# Altium schematic sheet Power.SchDoc
size A3
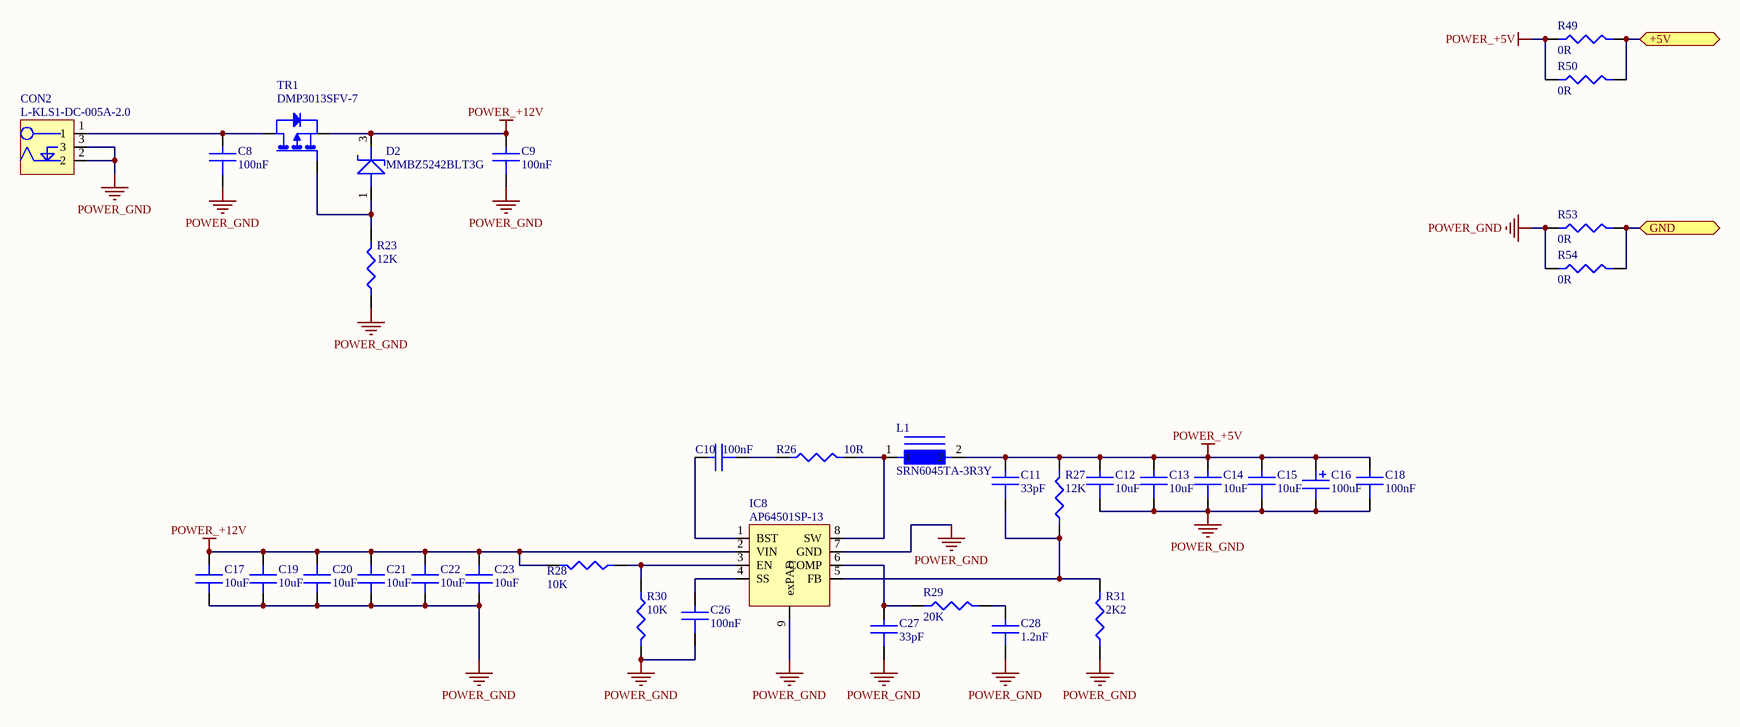
[diagram p0: Power.SchDoc]

## Parts
C8  100nF  [C0805]
C9  100nF  [C0603]
C10  100nF  [C0603]
C11  33pF  [C0603]
C12  10uF  [C0603]
C13  10uF  [C0603]
C14  10uF  [C0603]
C15  10uF  [C0603]
C16  100uF  [CT3528]
C17  10uF  [C0805]
C18  100nF  [C0603]
C19  10uF  [C0805]
C20  10uF  [C0805]
C21  10uF  [C0805]
C22  10uF  [C0805]
C23  10uF  [C0805]
C26  100nF  [C0603]
C27  33pF  [C0603]
C28  1.2nF  [C0603]
CON2  L-KLS1-DC-005A-2.0  [L-KLS1-DC-005A-2.0]
D2  MMBZ5242BLT3G  [SOT23]
IC8  AP64501SP-13  [SO-8EP]
L1  SRN6045TA-3R3Y  [SRN6045TA]
R23  12K  [R0603]
R26  10R  [R0603]
R27  12K  [R0603]
R28  10K  [R0603]
R29  20K  [R0603]
R30  10K  [R0603]
R31  2K2  [R0603]
R49  0R  [R0603]
R50  0R  [R0603]
R53  0R  [R0603]
R54  0R  [R0603]
TR1  DMP3013SFV-7  [PowerDI3333-8]

## Ports
+5V (bidir), GND (bidir)

## Nets
POWER_+5V: C11.1 C12.1 C13.1 C14.1 C15.1 C16.1 C18.1 L1.2 R27.2 R49.1 R50.1
POWER_+12V: C9.1 C17.2 C19.2 C20.2 C21.2 C22.2 C23.2 D2.3(K) IC8.2(VIN) R28.2 TR1.1(S)
POWER_GND: C8.2 C9.2 C12.2 C13.2 C14.2 C15.2 C16.2 C17.1 C18.2 C19.1 C20.1 C21.1 C22.1 C23.1 C26.2 C27.2 C28.2 CON2.2 CON2.3 IC8.7(GND) IC8.9(exPAD) R23.1 R30.2 R31.1 R53.1 R54.1
+5V: R49.2 R50.2 ; port +5V
GND: R53.2 R54.2 ; port GND
NetC8_1: C8.1 CON2.1 TR1.3(D)
NetC10_1: C10.1 IC8.1(BST)
NetC10_2: C10.2 R26.1
NetC11_2: C11.2 IC8.5(FB) R27.1 R31.2
NetC26_1: C26.1 IC8.4(SS)
NetC27_1: C27.1 IC8.6(COMP) R29.1
NetC28_1: C28.1 R29.2
NetD2_1: D2.1(A) R23.2 TR1.2(G)
NetIC8_3: IC8.3(EN) R28.1 R30.1
NetIC8_8: IC8.8(SW) L1.1 R26.2

## Notes on the sheet
- Tarih/Date
- Kont/Check
- Onay/Appr
- Haz/Prep
- Ortam/Env
- Sayfa/Sht
- Form
- /
- Deg Tarihi/Chng Date
- Deg Onay/Chng Appr
- Rev
- All rights reserved. No part of this document may be reproduced or transmitted in any form or by any means, electronic, mechanical, photocopying, recording, or otherwise, without prior written permission of

## Library data of the parts
C8 = CL21B104MBCNNNC: 100nF 50V X7R 20% SMD 0805 125C Paper T/R; Manufacturer: Samsung; Supplier 1: Digi-Key; Manufacturer Part Number: CL21B104MBCNNNC; Stock 1: 602; Pricing 1: 1 = 0,10000, 10 = 0,04500, 100 = 0,02020, 500 = 0,01444, 1000 = 0,01134 (USD); RoHS: Yes; Mount: Surface Mount; Case/Package: 0805; Case Code (Imperial): 0805; Case Code (Metric): 2012; Min Operating Temperature: -55°C; Max Operating Temperature: 125°C; Capacitance: 100nF; Tolerance: 20%; Dielectric: X7R; Voltage: 50V; Package Quantity: 1; Packaging: Tape and Reel; Voltage Rating: 50V; Voltage Rating (DC): 50V; Length: 2mm; Height: 0.85mm; Depth: 1.25mm; Width: 0.049inch; Thickness: 0.037inch; Radiation Hardening: No; Lead Free: Lead Free; ComponentLink1URL: https://datasheet.ciiva.com/25780/cl21b104mbcnnnc-25780224.pdf?src-supplier=Digi-Key; ComponentLink1Description: https://datasheet.ciiva.com/25780/cl21b104mbcnnnc-25780224.pdf?src-supplier=Digi-Key; ComponentLink2URL: https://datasheet.ciiva.com/16428/cl21b104mbcnnnc-16428869.pdf?src-supplier=Future+Electronics; ComponentLink2Description: https://datasheet.ciiva.com/16428/cl21b104mbcnnnc-16428869.pdf?src-supplier=Future+Electronics; ComponentLink3URL: https://datasheet.ciiva.com/26838/getdatasheetpartid-746552-26838664.pdf?src-supplier=Verical; ComponentLink3Description: https://datasheet.ciiva.com/26838/getdatasheetpartid-746552-26838664.pdf?src-supplier=Verical; Supplier Part Number 1: 1276-2450-1-ND; Category: Capasitor
C9 C10 C18 C26 = CC0603KRX7R8BB104: 100nF, 25V, X7R, 10%, 0603; Manufacturer: Yageo; Supplier 1: Digi-Key; Supplier Part Number 1: 311-1341-1-ND; Manufacturer Part Number: CC0603KRX7R8BB104; Stock 1: 10150433; Pricing 1: 1 = 0,10000, 10 = 0,04500, 50 = 0,02480, 100 = 0,02020, 500 = 0,01444, 1000 = 0,01134 (USD); RoHS: Yes; Mount: Surface Mount; Case/Package: 0603; Number of Pins: 2; Case Code (Imperial): 0603; Case Code (Metric): 1608; Min Operating Temperature: -55°C; Max Operating Temperature: 125°C; Capacitance: 100nF; Tolerance: 10%; Voltage Rating: 25V; Packaging: Tape and Reel; Package Quantity: 1; Voltage Rating (DC): 25V; Dielectric: X7R; Termination: SMD/SMT; Resistor Type: Ceramic; Voltage: 25V; Length: 1.6mm; Width: 0.8mm; Height: 0.8mm; Thickness: 0.035inch; Depth: 0.8mm; Radiation Hardening: No; REACH SVHC: Unknown; Lead Free: Lead Free; Halogen Free: Halogen Free; ComponentLink1URL: https://datasheet.ciiva.com/11786/0900766b80c10176-11786120.pdf?src-supplier=RSComponents; ComponentLink1Description: https://datasheet.ciiva.com/11786/0900766b80c10176-11786120.pdf?src-supplier=RSComponents; ComponentLink2URL: https://datasheet.ciiva.com/144/mlccorderingcode-144075.pdf?src-supplier=Digi-Key; ComponentLink2Description: https://datasheet.ciiva.com/144/mlccorderingcode-144075.pdf?src-supplier=Digi-Key; ComponentLink3URL: https://datasheet.ciiva.com/17434/upy-gphc-x7r-6-3v-to-50v-8-17434263.pdf?src-supplier=Avnet+Europe; ComponentLink3Description: https://datasheet.ciiva.com/17434/upy-gphc-x7r-6-3v-to-50v-8-17434263.pdf?src-supplier=Avnet+Europe; ComponentLink4URL: https://datasheet.ciiva.com/26829/getdatasheetpartid-403577-26829431.pdf?src-supplier=Verical; ComponentLink4Description: https://datasheet.ciiva.com/26829/getdatasheetpartid-403577-26829431.pdf?src-supplier=Verical; ComponentLink5URL: https://datasheet.ciiva.com/11587/upy-gphc-x7r-6-3v-to-50v-8-11587208.pdf?src-supplier=Avnet; ComponentLink5Description: https://datasheet.ciiva.com/11587/upy-gphc-x7r-6-3v-to-50v-8-11587208.pdf?src-supplier=Avnet; ComponentLink6URL: https://datasheet.ciiva.com/13389/upy-gphc-x7r-6-3v-to-50v-8-13389352.pdf?src-supplier=Mouser; ComponentLink6Description: https://datasheet.ciiva.com/13389/upy-gphc-x7r-6-3v-to-50v-8-13389352.pdf?src-supplier=Mouser; ComponentLink7URL: https://datasheet.ciiva.com/28450/1489800-28450584.pdf?src-supplier=Element14; ComponentLink7Description: https://datasheet.ciiva.com/28450/1489800-28450584.pdf?src-supplier=Element14; ComponentLink8URL: https://datasheet.ciiva.com/144/mlccorderingcode-144073.pdf?src-supplier=Digi-Key; ComponentLink8Description: https://datasheet.ciiva.com/144/mlccorderingcode-144073.pdf?src-supplier=Digi-Key; ComponentLink9URL: https://datasheet.ciiva.com/144/mlccorderingcode-144074.pdf?src-supplier=Digi-Key; ComponentLink9Description: https://datasheet.ciiva.com/144/mlccorderingcode-144074.pdf?src-supplier=Digi-Key; ComponentLink10URL: https://datasheet.ciiva.com/7978/1489800-7978155.pdf?src-supplier=Element14; ComponentLink10Description: https://datasheet.ciiva.com/7978/1489800-7978155.pdf?src-supplier=Element14; Category: Capasitor
C11 C27 = CC0603JRNPO9BN330: 33PF ,50V ,NP0 ,0603; Manufacturer: Yageo; Dielectric Material: Ceramic; Tolerance: 5%; Dielectric: C0G; Temperature Coefficient: 30ppm/°C; Insulation Resistance: 100GR; Supplier 1: Digi-Key; Supplier Part Number 1: 311-1064-1-ND; Manufacturer Part Number: CC0603JRNPO9BN330; Stock 1: 152637; Pricing 1: 1 = 0,10000, 10 = 0,04200, 50 = 0,02320, 100 = 0,01890, 500 = 0,01352, 1000 = 0,01062 (USD); RoHS: Yes; Mount: Surface Mount; Case/Package: 0603; Number of Pins: 2; Case Code (Metric): 1608; Case Code (Imperial): 0603; Min Operating Temperature: -55°C; Max Operating Temperature: 125°C; Capacitance: 33pF; Packaging: Tape and Reel; Voltage Rating: 50V; Package Quantity: 1; Voltage Rating (DC): 50V; Termination: SMD/SMT; Resistor Type: Ceramic; Voltage: 50V; Length: 1.6mm; Width: 0.031inch; Height: 0.8mm; Thickness: 0.035inch; Depth: 0.8mm; Radiation Hardening: No; REACH SVHC: No SVHC; Lead Free: Lead Free; ComponentLink1URL: https://datasheet.ciiva.com/11786/0900766b8079c870-11786082.pdf?src-supplier=RSComponents; ComponentLink1Description: https://datasheet.ciiva.com/11786/0900766b8079c870-11786082.pdf?src-supplier=RSComponents; ComponentLink2URL: https://datasheet.ciiva.com/26862/getdatasheetpartid-403532-26862767.pdf?src-supplier=Verical; ComponentLink2Description: https://datasheet.ciiva.com/26862/getdatasheetpartid-403532-26862767.pdf?src-supplier=Verical; ComponentLink3URL: https://datasheet.ciiva.com/144/mlccorderingcode-144643.pdf?src-supplier=Digi-Key; ComponentLink3Description: https://datasheet.ciiva.com/144/mlccorderingcode-144643.pdf?src-supplier=Digi-Key; ComponentLink4URL: https://datasheet.ciiva.com/144/mlccorderingcode-144644.pdf?src-supplier=Digi-Key; ComponentLink4Description: https://datasheet.ciiva.com/144/mlccorderingcode-144644.pdf?src-supplier=Digi-Key; ComponentLink5URL: https://datasheet.ciiva.com/144/mlccorderingcode-144645.pdf?src-supplier=Digi-Key; ComponentLink5Description: https://datasheet.ciiva.com/144/mlccorderingcode-144645.pdf?src-supplier=Digi-Key; ComponentLink6URL: https://datasheet.ciiva.com/5426/upy-gp-np0-16v-to-50v-8-5426614.pdf?src-supplier=Mouser; ComponentLink6Description: https://datasheet.ciiva.com/5426/upy-gp-np0-16v-to-50v-8-5426614.pdf?src-supplier=Mouser; ComponentLink7URL: https://datasheet.ciiva.com/8033/1372269-8033734.pdf?src-supplier=Element14; ComponentLink7Description: https://datasheet.ciiva.com/8033/1372269-8033734.pdf?src-supplier=Element14; ComponentLink8URL: https://datasheet.ciiva.com/8033/1443161-8033735.pdf?src-supplier=Element14; ComponentLink8Description: https://datasheet.ciiva.com/8033/1443161-8033735.pdf?src-supplier=Element14; ComponentLink9URL: https://datasheet.ciiva.com/11464/upy-gp-np0-16v-to-50v-8-11464730.pdf?src-supplier=Avnet; ComponentLink9Description: https://datasheet.ciiva.com/11464/upy-gp-np0-16v-to-50v-8-11464730.pdf?src-supplier=Avnet; ComponentLink10URL: https://datasheet.ciiva.com/46430/1835847-46430155.pdf?src-supplier=Element14; ComponentLink10Description: https://datasheet.ciiva.com/46430/1835847-46430155.pdf?src-supplier=Element14; ComponentLink11URL: https://datasheet.ciiva.com/7978/1443161-7978142.pdf?src-supplier=Element14; ComponentLink11Description: https://datasheet.ciiva.com/7978/1443161-7978142.pdf?src-supplier=Element14; Category: Capasitor
C12-C15 = CC0603MRX5R6BB106: 10uF 10V X5R 20% SMD 0603 85C Paper T/R; Manufacturer: Yageo; Supplier 1: Digi-Key; Supplier Part Number 1: 311-1817-1-ND; Manufacturer Part Number: CC0603MRX5R6BB106; Stock 1: 209492; Pricing 1: 1 = 0,20000, 10 = 0,13700, 50 = 0,08200, 100 = 0,06920, 500 = 0,04736, 1000 = 0,04190 (USD); RoHS: Yes; Mount: Surface Mount; Case/Package: 0603; Case Code (Imperial): 0603; Case Code (Metric): 1608; Weight: 7.1E-05oz; Min Operating Temperature: -55°C; Max Operating Temperature: 85°C; Voltage Rating: 10V; Termination: SMD/SMT; Resistor Type: Ceramic; Dielectric: X5R; Tolerance: 20%; Packaging: Tape and Reel; Capacitance: 10uF; Voltage Rating (DC): 10V; Length: 0.063inch; Width: 0.031inch; Thickness: 0.035inch; Depth: 0.8mm; Lead Free: Lead Free; Halogen Free: Halogen Free; ComponentLink1URL: http://components.arrow.com/part/dataview/0323_03079270?src-supplier=Arrow+Europe; ComponentLink1Description: http://components.arrow.com/part/dataview/0323_03079270?src-supplier=Arrow+Europe; ComponentLink2URL: http://www.mouser.com/ds/2/447/UPY-GPHC_X5R_4V-to-50V_25-1131599.pdf?src-supplier=Mouser; ComponentLink2Description: http://www.mouser.com/ds/2/447/UPY-GPHC_X5R_4V-to-50V_25-1131599.pdf?src-supplier=Mouser; ComponentLink3URL: http://www.yageo.com/documents/recent/UPY-GPHC_X5R_4V-to-50V_25.pdf?src-supplier=Digi-Key; ComponentLink3Description: http://www.yageo.com/documents/recent/UPY-GPHC_X5R_4V-to-50V_25.pdf?src-supplier=Digi-Key; Category: Capasitor
C16 = T491B107K006AT: 100uF ,6V ,Tantalum ,Case B; Manufacturer: KEMET; Voltage Rating: 6.3V; Tolerance: 10%; ESR (Equivalent Series Resistance): 3R; Life (Hours): 2000Hour; Dissipation Factor: 15%; Polarity: Polar; Leakage Current: 6.3uA; Supplier 1: Digi-Key; Supplier Part Number 1: 399-8301-1-ND; Manufacturer Part Number: T491B107K006AT; Stock 1: 3756; Pricing 1: 1 = 0,96000, 10 = 0,73200, 50 = 0,60820, 100 = 0,52360, 500 = 0,40540, 1000 = 0,34910 (USD); RoHS: Yes; Mount: Surface Mount; Case/Package: 1411; Number of Pins: 2; Dielectric Material: Tantalum; Case Code (Imperial): 1411; Case Code (Metric): 3528; Min Operating Temperature: -55°C; Max Operating Temperature: 125°C; Capacitance: 100uF; Packaging: Tape and Reel; Package Quantity: 1; Features: General Purpose; Termination: SMD/SMT; Voltage Rating (DC): 6V; Failure Rate: 0.001%; Voltage: 6.3V; Length: 3.5mm; Width: 2.8mm; Height: 1.9mm; Height - Seated (Max): 0.083inch; Depth: 2.8mm; Radiation Hardening: No; REACH SVHC: No SVHC; Lead Free: Lead Free; ComponentLink1URL: https://datasheet.ciiva.com/6228/kem-t2005-t491-6228472.pdf?src-supplier=Digi-Key; ComponentLink1Description: https://datasheet.ciiva.com/6228/kem-t2005-t491-6228472.pdf?src-supplier=Digi-Key; ComponentLink2URL: https://datasheet.ciiva.com/5933/1446014-5933946.pdf?src-supplier=Farnell; ComponentLink2Description: https://datasheet.ciiva.com/5933/1446014-5933946.pdf?src-supplier=Farnell; ComponentLink3URL: https://datasheet.ciiva.com/46385/1854511-46385387.pdf?src-supplier=Element14; ComponentLink3Description: https://datasheet.ciiva.com/46385/1854511-46385387.pdf?src-supplier=Element14; ComponentLink4URL: https://datasheet.ciiva.com/6228/kem-t2005-t491-6228470.pdf?src-supplier=Digi-Key; ComponentLink4Description: https://datasheet.ciiva.com/6228/kem-t2005-t491-6228470.pdf?src-supplier=Digi-Key; ComponentLink5URL: https://datasheet.ciiva.com/6228/kem-t2005-t491-6228471.pdf?src-supplier=Digi-Key; ComponentLink5Description: https://datasheet.ciiva.com/6228/kem-t2005-t491-6228471.pdf?src-supplier=Digi-Key; ComponentLink6URL: https://datasheet.ciiva.com/5933/1851156-5933948.pdf?src-supplier=Farnell; ComponentLink6Description: https://datasheet.ciiva.com/5933/1851156-5933948.pdf?src-supplier=Farnell; Category: Capasitor
C17 C19-C23 = GRM21BC8YA106ME11L: 10uF ,35 V X6S ,0805; Manufacturer: Murata; Tolerance: 20%; Voltage Rating: 35V; Supplier 1: Digi-Key; Supplier Part Number 1: 490-10505-1-ND; Manufacturer Part Number: GRM21BC8YA106ME11L; Stock 1: 67295; Pricing 1: 1 = 0,42000, 10 = 0,28900, 50 = 0,20220, 100 = 0,17320, 500 = 0,12994, 1000 = 0,10972 (USD); RoHS: Yes; Mount: Surface Mount; Case/Package: 0805; Case Code (Imperial): 0805; Case Code (Metric): 2012; Min Operating Temperature: -55°C; Max Operating Temperature: 105°C; Packaging: Tape and Reel; Capacitance: 10uF; Voltage Rating (DC): 35V; Dielectric: X6S; Length: 0.079inch; Width: 0.049inch; Thickness: 0.057inch; ComponentLink1URL: http://search.murata.co.jp/Ceramy/image/img/A01X/G101/ENG/GRM21BC8YA106ME11-01.pdf?src-supplier=Digi-Key; ComponentLink1Description: http://search.murata.co.jp/Ceramy/image/img/A01X/G101/ENG/GRM21BC8YA106ME11-01.pdf?src-supplier=Digi-Key; ComponentLink2URL: http://search.murata.co.jp/Ceramy/image/img/A01X/partnumbering_e_01.pdf?src-supplier=Digi-Key; ComponentLink2Description: http://search.murata.co.jp/Ceramy/image/img/A01X/partnumbering_e_01.pdf?src-supplier=Digi-Key; Category: Capasitor
C28 = CC0603KRX7R9BB122: 1.2nF ,50V ,X7R ,0603; Manufacturer: Yageo; Dielectric Material: Ceramic; Tolerance: 10%; Insulation Resistance: 100GR; Supplier 1: Digi-Key; Supplier Part Number 1: 311-1806-1-ND; Manufacturer Part Number: CC0603KRX7R9BB122; Stock 1: 29509; Pricing 1: 1 = 0,10000, 10 = 0,06600, 50 = 0,03620, 100 = 0,02950, 500 = 0,02106, 1000 = 0,01655 (USD); RoHS: Yes; Mount: Surface Mount; Case/Package: 0603; Case Code (Metric): 1608; Case Code (Imperial): 0603; Weight: 7.1E-05oz; Min Operating Temperature: -55°C; Max Operating Temperature: 125°C; Voltage Rating: 50V; Voltage Rating (DC): 50V; Capacitance: 1.2nF; Package Quantity: 4000; Dielectric: X7R; Termination: SMD/SMT; Resistor Type: Ceramic; Length: 1.6mm; Width: 0.031inch; Height: 0.8mm; Thickness: 0.035inch; Depth: 0.8mm; Radiation Hardening: No; REACH SVHC: Unknown; Lead Free: Lead Free; Halogen Free: Halogen Free; ComponentLink1URL: https://datasheet.ciiva.com/8033/1489800-8033829.pdf?src-supplier=Element14; ComponentLink1Description: https://datasheet.ciiva.com/8033/1489800-8033829.pdf?src-supplier=Element14; ComponentLink2URL: https://datasheet.ciiva.com/16623/upy-gphc-x7r-6-3v-to-50v-8-16623895.pdf?src-supplier=Avnet+Europe; ComponentLink2Description: https://datasheet.ciiva.com/16623/upy-gphc-x7r-6-3v-to-50v-8-16623895.pdf?src-supplier=Avnet+Europe; ComponentLink3URL: https://datasheet.ciiva.com/13209/upy-gphc-x7r-6-3v-to-50v-8-12304-13209023.pdf?src-supplier=Mouser; ComponentLink3Description: https://datasheet.ciiva.com/13209/upy-gphc-x7r-6-3v-to-50v-8-12304-13209023.pdf?src-supplier=Mouser; Packaging: Tape and Reel; Category: Capasitor
CON2 = L-KLS1-DC-005A-2.0: CONN JACK R/A PCB 5.5X2.5MM; Manufacturer: KLS ELECTRONIC; Supplier 1: Ozdisan; Supplier Part Number 1: L-KLS1-DC-005A-2.0; Manufacturer Part Number: L-KLS1-DC-005A-2.0; Stock 1: 1979; Pricing 1: 1 = 0,2 500 = 0.18; RoHS: No; Category: Connectors, Interconnects Barrel - Power Connectors; ComponentLink1Description: L-KLS1-DC-005A-2.0; ComponentLink1URL: https://cdn.ozdisan.com/ETicaret_Dosya/508049_4541161.pdf
D2 = MMBZ5242BLT3G: DIODE ZENER 12V 225MW SOD23-3; Manufacturer: ON Semiconductor; Impedance: 30R; Voltage Tolerance: 5%; Power Dissipation: 300mW; Max Reverse Leakage Current: 1uA; Element Configuration: Single; Supplier 1: Digi-Key; Supplier Part Number 1: MMBZ5242BLT3GOSCT-ND; Manufacturer Part Number: MMBZ5242BLT3G; Stock 1: 39036; Pricing 1: 1 = 0,13000, 10 = 0,09200, 100 = 0,04950, 500 = 0,03888, 1000 = 0,02700, 2000 = 0,02237, 5000 = 0,02115 (USD); RoHS: Yes; Case/Package: SOT-23-3; Number of Pins: 3; Min Operating Temperature: -65°C; Max Operating Temperature: 150°C; Package Quantity: 10000; Packaging: Tape and Reel; Zener Voltage: 12V; Max Power Dissipation: 225mW; Tolerance: 5%; Lead Free: Lead Free; ComponentLink1URL: https://datasheet.ciiva.com/24020/mmbz5221blt1-d-24020127.pdf?src-supplier=Mouser; ComponentLink1Description: https://datasheet.ciiva.com/24020/mmbz5221blt1-d-24020127.pdf?src-supplier=Mouser; Category: Diodes - Zener - Single
IC8 = AP64501SP-13: Buck Switching Regulator IC Positive Adjustable 0.8V 1 Output 5A 8-SOIC (0.154", 3.90mm Width) Exposed Pad; Manufacturer: Diodes; Supplier 1: Digi-Key; Manufacturer Part Number: AP64501SP-13; Stock 1: 17836; Pricing 1: 1 = 2,30000, 10 = 2,06700, 25 = 1,95000, 100 = 1,56000, 250 = 1,36500, 500 = 1,32600, 1000 = 1,05300 (USD); RoHS: No; Category: Integrated Circuits - PMIC - Voltage Regulators - DC DC Switching Regulators; Supplier Part Number 1: 31-AP64501SP-13CT-ND
L1 = SRN6045TA-3R3Y: BOURNS - SRN6045TA-3R3Y - Power Inductor (SMD), 3.3 µH, 5 A, Semishielded, 7.8 A, SRN6045TA Series, 6mm x 6mm x 4.2mm; Inductance Tolerance: 30%; Inductance: 3.3uH; RMS Current (Irms): 5A; Saturation Current: 7.8A; DC Resistance (DCR): 21mR; Manufacturer: Bourns; Manufacturer Part Number: SRN6045TA-3R3Y; Stock 1: 3000; Pricing 1: 1000 = 0,18970, 2000 = 0,17920, 2000 = 0,37000, 20000 = 0,34830, 200000 = 0,22370, 1000000 = 0,16230, 2000000 = 0,16190 (USD); RoHS: No; Mount: Surface Mount; Packaging: Cut Tape; REACH SVHC: No SVHC; ComponentLink1URL: http://www.farnell.com/datasheets/2647414.pdf?src-supplier=Farnell; ComponentLink1Description: http://www.farnell.com/datasheets/2647414.pdf?src-supplier=Farnell; ComponentLink2URL: http://www.farnell.com/datasheets/2113223.pdf?src-supplier=Element14; ComponentLink2Description: http://www.farnell.com/datasheets/2113223.pdf?src-supplier=Element14; ComponentLink3URL: https://www.bourns.com/docs/Product-Datasheets/SRN6045TA.pdf?src-supplier=Digi-Key; ComponentLink3Description: https://www.bourns.com/docs/Product-Datasheets/SRN6045TA.pdf?src-supplier=Digi-Key; ComponentLink4URL: http://www.farnell.com/datasheets/2647414.pdf?src-supplier=Newark; ComponentLink4Description: http://www.farnell.com/datasheets/2647414.pdf?src-supplier=Newark; Supplier 1: Digi-Key; Supplier Part Number 1: SRN6045TA-3R3YCT-ND; Category: Inductors, Coils, Chokes Fixed Inductors
R23 = RC0603FR-0712KL: 12K ,%1 ,1/10 W ,0603; Manufacturer: Yageo; Resistance: 12kR; Tolerance: 1%; Power Rating: 100mW; Voltage Rating (DC): 50V; Temperature Coefficient: 100ppm/°C; Supplier 1: Digi-Key; Supplier Part Number 1: 311-12.0KHRCT-ND; Manufacturer Part Number: RC0603FR-0712KL; Stock 1: 979649; Pricing 1: 1 = 0,10000, 10 = 0,02100, 100 = 0,00840, 1000 = 0,00379, 2500 = 0,00329 (USD); RoHS: Yes; Case/Package: 0603; Number of Pins: 2; Case Code (Imperial): 0603; Case Code (Metric): 1608; Min Operating Temperature: -55°C; Max Operating Temperature: 155°C; Packaging: Tape and Reel; Voltage Rating: 50V; Termination: SMD/SMT; Resistor Type: Thick Film; Package Quantity: 1; Number of Terminations: 2; Max Power Dissipation: 100mW; Features: Moisture Resistant; Length: 0.063inch; Width: 0.031inch; Height: 0.022inch; Depth: 0.8mm; REACH SVHC: No SVHC; Lead Free: Lead Free; Military Standard: Not; Category: Resistor
R26 = RC0603FR-0710RL: 10R, 1%, 1/10W, 0603; Manufacturer: Yageo; Voltage Rating (DC): 50V; Temperature Coefficient: 200ppm/°C; Power Rating: 100mW; Supplier 1: Digi-Key; Supplier Part Number 1: 311-10.0HRCT-ND; Manufacturer Part Number: RC0603FR-0710RL; Stock 1: 7663236; Pricing 1: 1 = 0,10000, 10 = 0,04100, 100 = 0,01690, 1000 = 0,00758, 2500 = 0,00658 (USD); RoHS: Yes; Case/Package: 0603; Number of Pins: 2; Case Code (Imperial): 0603; Case Code (Metric): 1608; Contact Plating: Tin,Matte; Min Operating Temperature: -55°C; Max Operating Temperature: 155°C; Packaging: Tape and Reel; Resistance: 10R; Tolerance: 1%; Resistor Type: Thick Film; Voltage Rating: 50V; Termination: SMD/SMT; Length: 1.6mm; Width: 0.8mm; Height: 0.45mm; Depth: 0.8mm; Radiation Hardening: No; REACH SVHC: No SVHC; Lead Free: Lead Free; Military Standard: Not; ComponentLink1URL: https://datasheet.ciiva.com/11808/0900766b80f96399-11808140.pdf?src-supplier=RSComponents; ComponentLink1Description: https://datasheet.ciiva.com/11808/0900766b80f96399-11808140.pdf?src-supplier=RSComponents; ComponentLink2URL: https://datasheet.ciiva.com/7746/443971-7746245.pdf?src-supplier=Element14; ComponentLink2Description: https://datasheet.ciiva.com/7746/443971-7746245.pdf?src-supplier=Element14; ComponentLink3URL: https://datasheet.ciiva.com/8891/pyu-rc0603-51-rohs-l-4-8891285.pdf?src-supplier=Avnet; ComponentLink3Description: https://datasheet.ciiva.com/8891/pyu-rc0603-51-rohs-l-4-8891285.pdf?src-supplier=Avnet; ComponentLink4URL: https://datasheet.ciiva.com/28386/pyu-rc0603-51-rohs-l-4-28386637.pdf?src-supplier=Avnet+Europe; ComponentLink4Description: https://datasheet.ciiva.com/28386/pyu-rc0603-51-rohs-l-4-28386637.pdf?src-supplier=Avnet+Europe; Category: Resistor
R27 = RC0603FR-0712KL: 12 kohm, 0603, 75 V, 1/10 W; Manufacturer: Yageo; Resistance: 12kR; Tolerance: 1%; Power Rating: 100mW; Voltage Rating (DC): 50V; Temperature Coefficient: 100ppm/°C; Supplier 1: Digi-Key; Supplier Part Number 1: 311-12.0KHRCT-ND; Manufacturer Part Number: RC0603FR-0712KL; Stock 1: 979649; Pricing 1: 1 = 0,10000, 10 = 0,02100, 100 = 0,00840, 1000 = 0,00379, 2500 = 0,00329 (USD); RoHS: Yes; Case/Package: 0603; Number of Pins: 2; Case Code (Imperial): 0603; Case Code (Metric): 1608; Min Operating Temperature: -55°C; Max Operating Temperature: 155°C; Packaging: Tape and Reel; Voltage Rating: 50V; Termination: SMD/SMT; Resistor Type: Thick Film; Package Quantity: 1; Number of Terminations: 2; Max Power Dissipation: 100mW; Features: Moisture Resistant; Length: 0.063inch; Width: 0.031inch; Height: 0.022inch; Depth: 0.8mm; REACH SVHC: No SVHC; Lead Free: Lead Free; Military Standard: Not; Category: Resistor
R28 R30 = RT0603FRE0710KL: 10K OHM 1% 1/10W 0603; Manufacturer: Yageo; Resistance: 10kR; Power Rating: 100mW; Voltage Rating: 75V; Temperature Coefficient: 50ppm/°C; Supplier 1: Digi-Key; Supplier Part Number 1: YAG2321CT-ND; Manufacturer Part Number: RT0603FRE0710KL; Stock 1: 326134; Pricing 1: 1 = 0,10000, 10 = 0,05600, 100 = 0,02270, 1000 = 0,01020, 2500 = 0,00886 (USD); RoHS: Yes; Case/Package: 0603; Number of Pins: 2; Case Code (Metric): 1608; Case Code (Imperial): 0603; Contact Plating: Tin,Lead; Min Operating Temperature: -55°C; Max Operating Temperature: 125°C; Package Quantity: 5000; Packaging: Tape and Reel; Tolerance: 1%; Resistor Type: Thin Film; Number of Terminations: 2; Termination: SMD/SMT; Max Power Dissipation: 100mW; Voltage Rating (DC): 75V; Features: Moisture Resistant; Length: 0.063inch; Width: 0.031inch; Height: 0.022inch; Depth: 0.8mm; REACH SVHC: Unknown; Military Standard: Not; Lead Free: Lead Free; ComponentLink1URL: https://datasheet.ciiva.com/2559/pyu-rt-1-to-0-05-rohs-l-5-2559482.pdf?src-supplier=Digi-Key; ComponentLink1Description: https://datasheet.ciiva.com/2559/pyu-rt-1-to-0-05-rohs-l-5-2559482.pdf?src-supplier=Digi-Key; ComponentLink2URL: https://datasheet.ciiva.com/16745/pyu-rt-1-to-0-05-rohs-l-4-16745739.pdf?src-supplier=Future+Electronics; ComponentLink2Description: https://datasheet.ciiva.com/16745/pyu-rt-1-to-0-05-rohs-l-4-16745739.pdf?src-supplier=Future+Electronics; ComponentLink3URL: https://datasheet.ciiva.com/12694/pyu-rt-1-to-0-05-rohs-l-4-12694910.pdf?src-supplier=Mouser; ComponentLink3Description: https://datasheet.ciiva.com/12694/pyu-rt-1-to-0-05-rohs-l-4-12694910.pdf?src-supplier=Mouser; Category: Resistor
R29 = RC0603FR-0720KL: 20K ,%1 ,1/10 W ,0603; Manufacturer: Yageo; Resistance: 20kR; Tolerance: 1%; Temperature Coefficient: 100ppm/°C; Voltage Rating (DC): 50V; Power Rating: 100mW; Supplier 1: Digi-Key; Supplier Part Number 1: 311-20.0KHRCT-ND; Manufacturer Part Number: RC0603FR-0720KL; Stock 1: 4513947; Pricing 1: 1 = 0,10000, 10 = 0,02100, 100 = 0,00840, 1000 = 0,00379, 2500 = 0,00329 (USD); RoHS: Yes; Case/Package: 0603; Number of Pins: 2; Case Code (Imperial): 0603; Case Code (Metric): 1608; Min Operating Temperature: -55°C; Max Operating Temperature: 155°C; Packaging: Tape and Reel; Resistor Type: Thick Film; Voltage Rating: 50V; Package Quantity: 1; Termination: SMD/SMT; Number of Terminations: 2; Max Power Dissipation: 100mW; Features: Moisture Resistant; Length: 0.063inch; Width: 0.031inch; Height: 0.022inch; Depth: 0.8mm; Lead Free: Lead Free; REACH SVHC: No SVHC; Military Standard: Not; ComponentLink1URL: https://datasheet.ciiva.com/11808/0900766b80f96399-11808275.pdf?src-supplier=RSComponents; ComponentLink1Description: https://datasheet.ciiva.com/11808/0900766b80f96399-11808275.pdf?src-supplier=RSComponents; ComponentLink2URL: https://datasheet.ciiva.com/22747/443971-22747525.pdf?src-supplier=Element14; ComponentLink2Description: https://datasheet.ciiva.com/22747/443971-22747525.pdf?src-supplier=Element14; ComponentLink3URL: https://datasheet.ciiva.com/2453/pyu-r-int-thick-7-2453910.pdf?src-supplier=Digi-Key; ComponentLink3Description: https://datasheet.ciiva.com/2453/pyu-r-int-thick-7-2453910.pdf?src-supplier=Digi-Key; ComponentLink4URL: https://datasheet.ciiva.com/2453/pyu-r-int-thick-7-2453911.pdf?src-supplier=Digi-Key; ComponentLink4Description: https://datasheet.ciiva.com/2453/pyu-r-int-thick-7-2453911.pdf?src-supplier=Digi-Key; ComponentLink5URL: https://datasheet.ciiva.com/2453/pyu-r-int-thick-7-2453912.pdf?src-supplier=Digi-Key; ComponentLink5Description: https://datasheet.ciiva.com/2453/pyu-r-int-thick-7-2453912.pdf?src-supplier=Digi-Key; Category: Resistor
R31 = RC0603FR-072K2L: 2K2, 1%, 0.1W, 0603; Manufacturer: Yageo; Resistance: 2.2kR; Power Rating: 100mW; Temperature Coefficient: 100ppm/°C; Voltage Rating: 50V; Supplier 1: Digi-Key; Supplier Part Number 1: 311-2.20KHRCT-ND; Manufacturer Part Number: RC0603FR-072K2L; Stock 1: 5062372; Pricing 1: 1 = 0,100000, 10 = 0,021000, 100 = 0,008400, 1000 = 0,003790, 2500 = 0,003290 (USD); RoHS: Yes; Case/Package: 0603; Case Code (Imperial): 0603; Case Code (Metric): 1608; Min Operating Temperature: -55°C; Max Operating Temperature: 155°C; Tolerance: 1%; Packaging: Tape and Reel; Package Quantity: 1; Termination: SMD/SMT; Resistor Type: Thick Film; Number of Terminations: 2; Max Power Dissipation: 100mW; Features: Moisture Resistant; Length: 1.6mm; Width: 0.031inch; Height: 0.022inch; Depth: 0.8mm; REACH SVHC: No SVHC; Lead Free: Lead Free; Military Standard: Not; ComponentLink1URL: https://datasheet.ciiva.com/46440/1868787-46440902.pdf?src-supplier=Element14; ComponentLink1Description: https://datasheet.ciiva.com/46440/1868787-46440902.pdf?src-supplier=Element14; ComponentLink2URL: https://datasheet.ciiva.com/2453/pyu-r-int-thick-7-2453943.pdf?src-supplier=Digi-Key; ComponentLink2Description: https://datasheet.ciiva.com/2453/pyu-r-int-thick-7-2453943.pdf?src-supplier=Digi-Key; ComponentLink3URL: https://datasheet.ciiva.com/7660/1868787-7660791.pdf?src-supplier=Element14; ComponentLink3Description: https://datasheet.ciiva.com/7660/1868787-7660791.pdf?src-supplier=Element14; ComponentLink4URL: https://datasheet.ciiva.com/2453/pyu-r-int-thick-7-2453944.pdf?src-supplier=Digi-Key; ComponentLink4Description: https://datasheet.ciiva.com/2453/pyu-r-int-thick-7-2453944.pdf?src-supplier=Digi-Key; ComponentLink5URL: https://datasheet.ciiva.com/2453/pyu-r-int-thick-7-2453945.pdf?src-supplier=Digi-Key; ComponentLink5Description: https://datasheet.ciiva.com/2453/pyu-r-int-thick-7-2453945.pdf?src-supplier=Digi-Key; ComponentLink6URL: https://datasheet.ciiva.com/7746/1738695-7746315.pdf?src-supplier=Element14; ComponentLink6Description: https://datasheet.ciiva.com/7746/1738695-7746315.pdf?src-supplier=Element14; ComponentLink7URL: https://datasheet.ciiva.com/7746/1738695-7746316.pdf?src-supplier=Element14; ComponentLink7Description: https://datasheet.ciiva.com/7746/1738695-7746316.pdf?src-supplier=Element14; ComponentLink8URL: https://datasheet.ciiva.com/46394/443971-46394958.pdf?src-supplier=Element14; ComponentLink8Description: https://datasheet.ciiva.com/46394/443971-46394958.pdf?src-supplier=Element14; Category: Resistor
R49 R50 R53 R54 = RC0603FR-070RL: 0R ,%1 ,1/10 W ,0603; Manufacturer: Yageo; Resistance: 0mR; Power Rating: 100mW; Tolerance: 1%; Voltage Rating: 50V; Temperature Coefficient: 200ppm/°C; Current Rating: 1A; Working Voltage: 75V; Supplier 1: Digi-Key; Supplier Part Number 1: 311-0.0HRCT-ND; Manufacturer Part Number: RC0603FR-070RL; Stock 1: 513794; Pricing 1: 1 = 0,10000, 10 = 0,01800, 25 = 0,01280, 50 = 0,00980, 100 = 0,00730, 250 = 0,00552, 500 = 0,00442, 1000 = 0,00326 (USD); RoHS: Yes; Case/Package: 0603; Number of Pins: 2; Case Code (Metric): 1608; Case Code (Imperial): 0603; Contact Plating: Tin,Matte; Min Operating Temperature: -55°C; Max Operating Temperature: 155°C; Packaging: Tape and Reel; Package Quantity: 5000; Resistor Type: Thick Film; Number of Terminations: 2; Termination: SMD/SMT; Max Power Dissipation: 100mW; Voltage Rating (DC): 50V; Features: Moisture Resistant; Length: 1.6mm; Width: 0.031inch; Height: 0.45mm; Depth: 0.8mm; Radiation Hardening: No; REACH SVHC: No SVHC; Military Standard: Not; Lead Free: Lead Free; ComponentLink1URL: https://datasheet.ciiva.com/11808/0900766b80f96399-11808172.pdf?src-supplier=RSComponents; ComponentLink1Description: https://datasheet.ciiva.com/11808/0900766b80f96399-11808172.pdf?src-supplier=RSComponents; ComponentLink2URL: https://datasheet.ciiva.com/5558/rc0603-272842-5558341.pdf?src-supplier=Mouser; ComponentLink2Description: https://datasheet.ciiva.com/5558/rc0603-272842-5558341.pdf?src-supplier=Mouser; ComponentLink3URL: https://datasheet.ciiva.com/46382/443971-46382072.pdf?src-supplier=Element14; ComponentLink3Description: https://datasheet.ciiva.com/46382/443971-46382072.pdf?src-supplier=Element14; ComponentLink4URL: https://datasheet.ciiva.com/29721/pyu-r-int-thick-7-29721178.pdf?src-supplier=Digi-Key; ComponentLink4Description: https://datasheet.ciiva.com/29721/pyu-r-int-thick-7-29721178.pdf?src-supplier=Digi-Key; ComponentLink5URL: https://datasheet.ciiva.com/5684/443971-5684699.pdf?src-supplier=Farnell; ComponentLink5Description: https://datasheet.ciiva.com/5684/443971-5684699.pdf?src-supplier=Farnell; ComponentLink6URL: https://datasheet.ciiva.com/7983/443971-7983627.pdf?src-supplier=Element14; ComponentLink6Description: https://datasheet.ciiva.com/7983/443971-7983627.pdf?src-supplier=Element14; ComponentLink7URL: https://datasheet.ciiva.com/29721/pyu-rc0603-51-rohs-l-4-29721179.pdf?src-supplier=Digi-Key; ComponentLink7Description: https://datasheet.ciiva.com/29721/pyu-rc0603-51-rohs-l-4-29721179.pdf?src-supplier=Digi-Key; ComponentLink8URL: https://datasheet.ciiva.com/22643/1868787-22643388.pdf?src-supplier=Element14; ComponentLink8Description: https://datasheet.ciiva.com/22643/1868787-22643388.pdf?src-supplier=Element14; Category: Resistor
TR1 = DMP3013SFV-7: MOSFET BVDSS: 25V 30V POWERDI333; Manufacturer: Diodes; Continuous Drain Current (ID): 35A; Rds On Max: 9.5mR; Input Capacitance: 1.674nF; Max Power Dissipation: 940mW; Supplier 1: Digi-Key; Supplier Part Number 1: DMP3013SFV-7DICT-ND; Manufacturer Part Number: DMP3013SFV-7; Stock 1: 611; Pricing 1: 1 = 0,55000, 10 = 0,46900, 25 = 0,43760, 100 = 0,32500, 500 = 0,25376, 1000 = 0,20625 (USD); RoHS: No; Mount: Surface Mount; Number of Pins: 8; Min Operating Temperature: -55°C; Max Operating Temperature: 150°C; Packaging: Tape and Reel; Drain to Source Voltage (Vdss): 30V; ComponentLink1URL: https://www.diodes.com/assets/Datasheets/DMP3013SFV.pdf?src-supplier=Digi-Key; ComponentLink1Description: https://www.diodes.com/assets/Datasheets/DMP3013SFV.pdf?src-supplier=Digi-Key; Category: Mosfet P-Channel